# Altium schematic sheet Schaltbox-Renault_Extension.SchDoc: Schaltbox für PC I/O Erweiterung
size A3; Organization: Schleißheimer GmbH; Address2: Am Kalkofen 10; Address3: D-61206 Wöllstadt; Address4: Deutschland; Revision: 1.0; SheetNumber: 3; SheetTotal: 3; PageSetup: Record=PageOptions|CenterHorizontal=True|CenterVertical=True|PrintScale=0.70|XCorrection=1.00|YCorrection=1.00|PrintKind=0|BorderSize=5000000|LeftOffset=0|BottomOffset=0|Orientation=2|PaperLength=1000|PaperWidth=1000|Scale=100|PaperSource=7|PrintQuality=-4|MediaType=1|DitherType=10|PrintScaleMode=1|PaperKind=A4|PaperIndex=9; DocumentName: Schaltbox.SchDoc
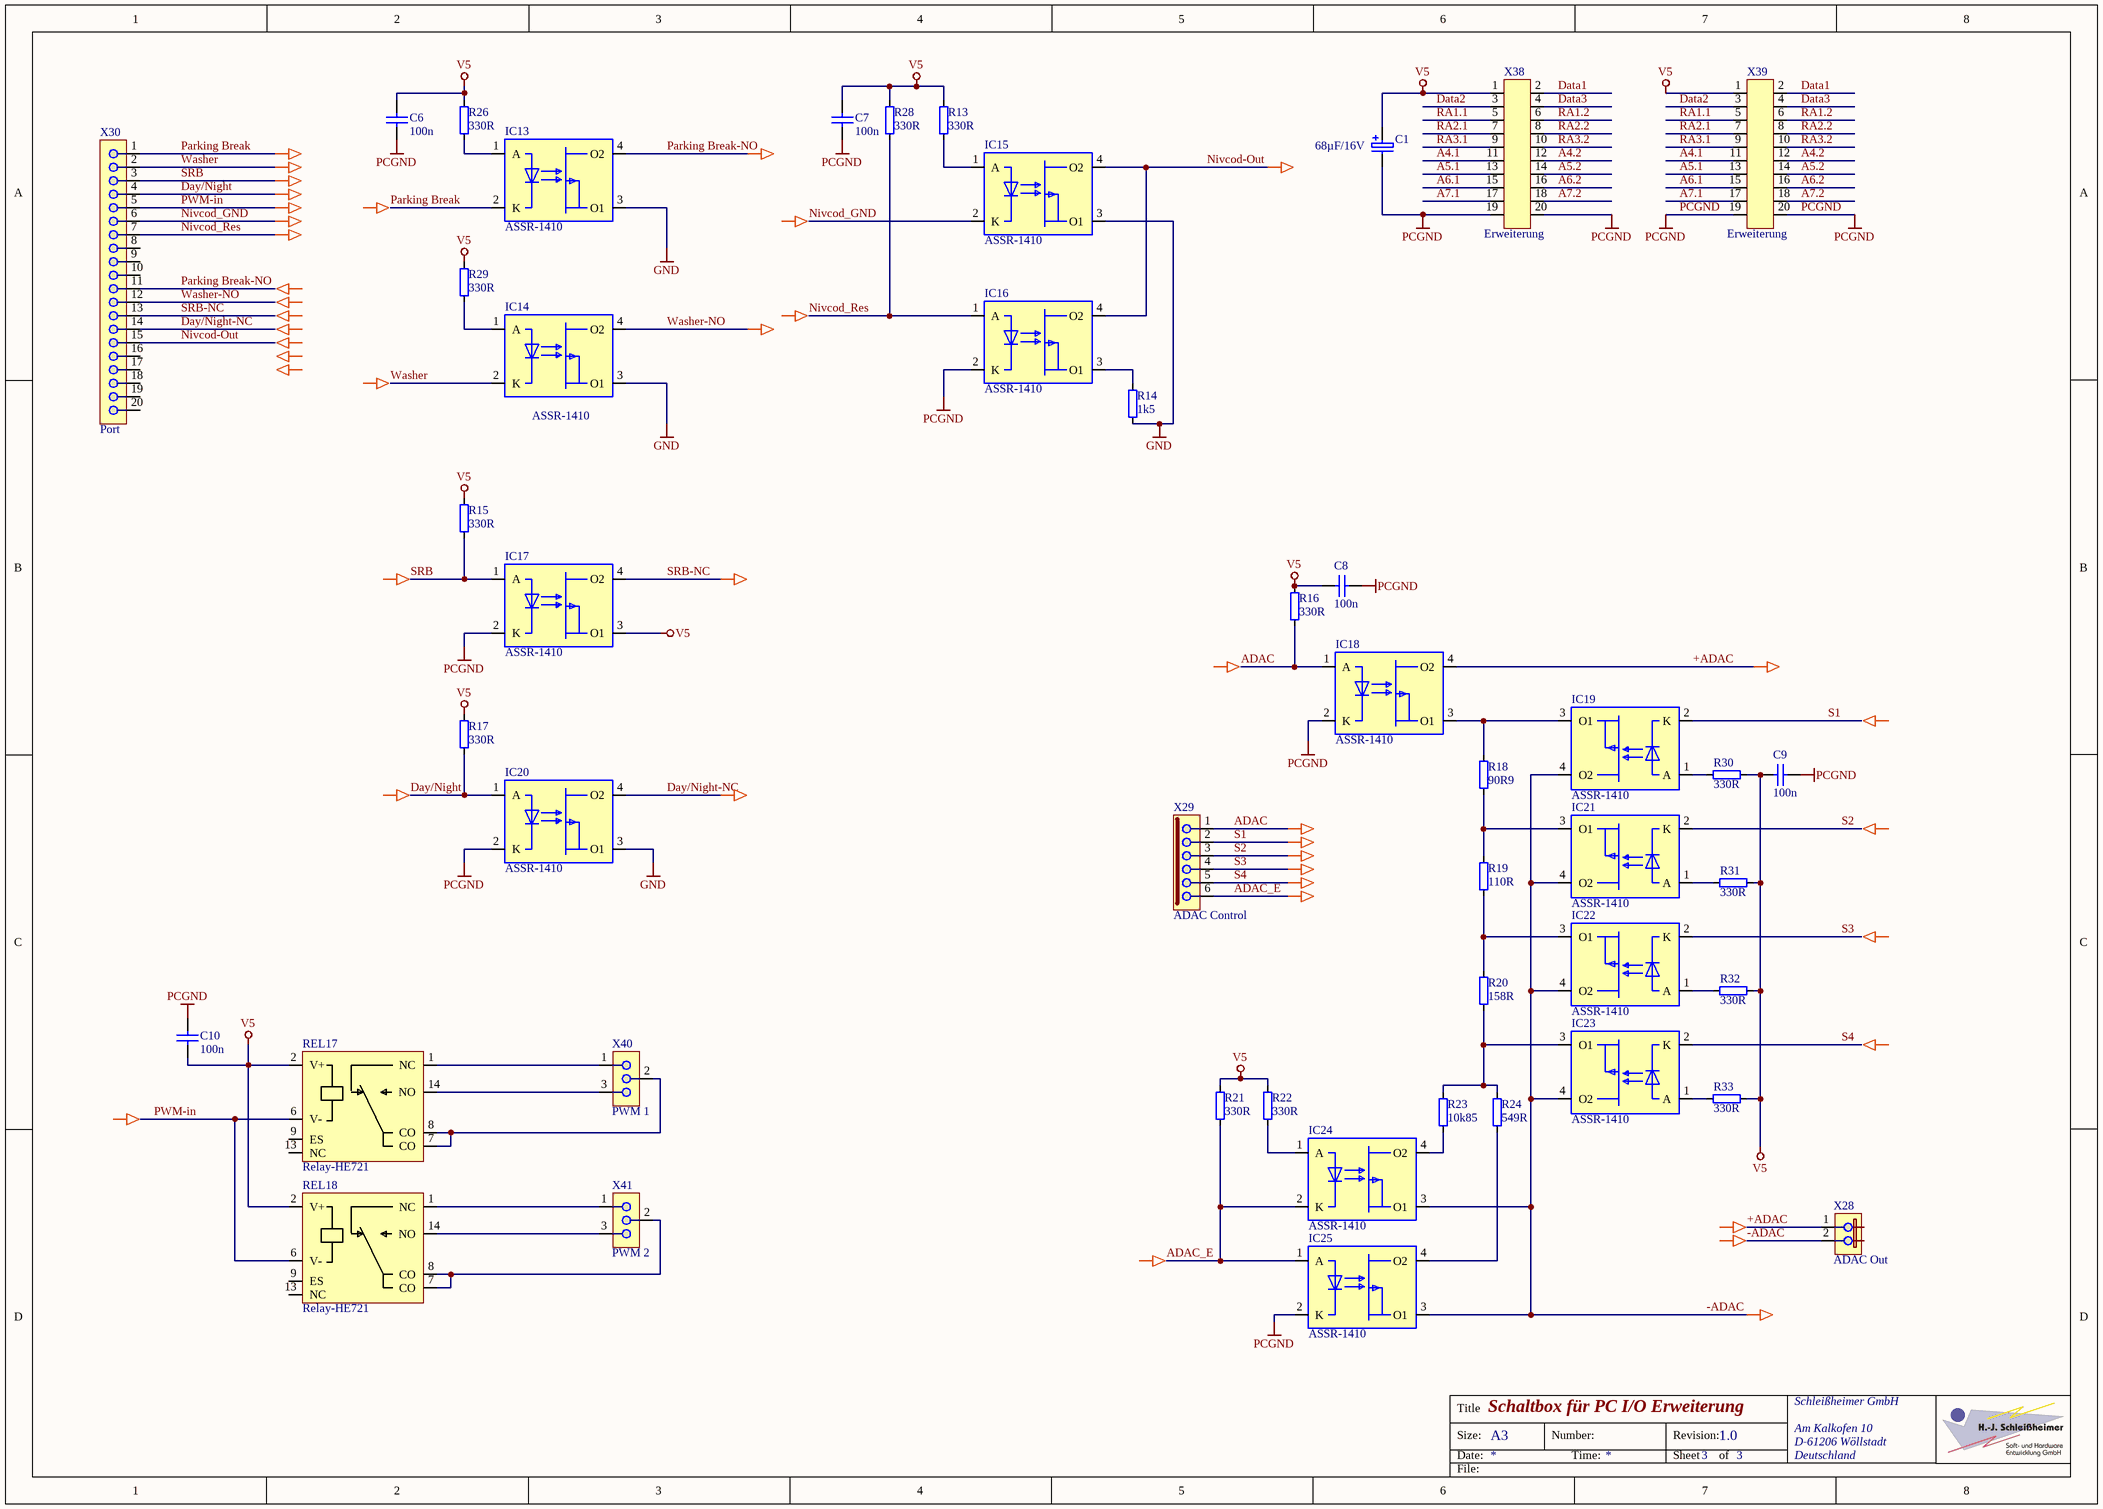
[diagram p0: Schaltbox-Renault_Extension.SchDoc]

## Parts
(Parts that share a designator on the sheet are numbered #1, #2 ... from top to bottom, then left to right.)
*#1  Pfeil-->  (value not drawn)  (graphical)
*#2  Pfeil-->  (value not drawn)  (graphical)
*#3  Pfeil-->  (value not drawn)  (graphical)
*#4  Pfeil-->  (value not drawn)  (graphical)
*#5  Pfeil-->  (value not drawn)  (graphical)
*#6  Pfeil-->  (value not drawn)  (graphical)
*#7  Pfeil-->  (value not drawn)  (graphical)
*#8  Pfeil-->  (value not drawn)  (graphical)
*#9  Pfeil-->  (value not drawn)  (graphical)
*#10  Pfeil-->  (value not drawn)  (graphical)
*#11  Pfeil-->  (value not drawn)  (graphical)
*#12  Pfeil-->  (value not drawn)  (graphical)
*#13  Pfeil-->  (value not drawn)  (graphical)
*#14  Pfeil-->  (value not drawn)  (graphical)
*#15  Pfeil-->  (value not drawn)  (graphical)
*#16  Pfeil-->  (value not drawn)  (graphical)
*#17  Pfeil-->  (value not drawn)  (graphical)
*#18  Pfeil-->  (value not drawn)  (graphical)
*#19  Pfeil-->  (value not drawn)  (graphical)
*#20  Pfeil-->  (value not drawn)  (graphical)
*#21  Pfeil-->  (value not drawn)  (graphical)
*#22  Pfeil-->  (value not drawn)  (graphical)
*#23  Pfeil-->  (value not drawn)  (graphical)
*#24  Pfeil-->  (value not drawn)  (graphical)
*#25  Pfeil-->  (value not drawn)  (graphical)
*#26  Pfeil-->  (value not drawn)  (graphical)
*#27  Pfeil-->  (value not drawn)  (graphical)
*#28  Pfeil-->  (value not drawn)  (graphical)
*#29  Pfeil-->  (value not drawn)  (graphical)
*#30  Pfeil-->  (value not drawn)  (graphical)
*#31  Pfeil-->  (value not drawn)  (graphical)
*#32  Pfeil-->  (value not drawn)  (graphical)
*#33  Pfeil-->  (value not drawn)  (graphical)
*#34  Pfeil-->  (value not drawn)  (graphical)
*#35  Pfeil-->  (value not drawn)  (graphical)
*#36  Pfeil-->  (value not drawn)  (graphical)
*#37  Pfeil-->  (value not drawn)  (graphical)
*#38  Pfeil-->  (value not drawn)  (graphical)
*#39  Pfeil-->  (value not drawn)  (graphical)
*#40  Pfeil-->  (value not drawn)  (graphical)
*#41  Pfeil-->  (value not drawn)  (graphical)
*#42  Pfeil-->  (value not drawn)  (graphical)
C1  68µF/16V  [ALU-D]
C6  100n  [C0603MD]
C7  100n  [C0603MD]
C8  100n  [C0603MD]
C9  100n  [C0603MD]
C10  100n  [C0603MD]
IC13  ASSR-1410  [SO-4]
IC14  ASSR-1410  [SO-4]
IC15  ASSR-1410  [SO-4]
IC16  ASSR-1410  [SO-4]
IC17  ASSR-1410  [SO-4]
IC18  ASSR-1410  [SO-4]
IC19  ASSR-1410  [SO-4]
IC20  ASSR-1410  [SO-4]
IC21  ASSR-1410  [SO-4]
IC22  ASSR-1410  [SO-4]
IC23  ASSR-1410  [SO-4]
IC24  ASSR-1410  [SO-4]
IC25  ASSR-1410  [SO-4]
R13  330R  [R0603MD]
R14  1k5  [R0603MD]
R15  330R  [R0603MD]
R16  330R  [R0603MD]
R17  330R  [R0603MD]
R18  90R9  [R0805MD]
R19  110R  [R0805MD]
R20  158R  [R0805MD]
R21  330R  [R0603MD]
R22  330R  [R0603MD]
R23  10k85  [R0805MD]
R24  549R  [R0805MD]
R26  330R  [R0603MD]
R28  330R  [R0603MD]
R29  330R  [R0603MD]
R30  330R  [R0603MD]
R31  330R  [R0603MD]
R32  330R  [R0603MD]
R33  330R  [R0603MD]
REL17  Relay-HE721  [DIP14 - HE700]
REL18  Relay-HE721  [DIP14 - HE700]
X28  ADAC Out  [Stifte_1x2]
X29  ADAC Control  [Stifte_1x6]
X30  Port  [Stifte_1x20]
X38  Erweiterung  [SchneidKlemm_20]
X39  Erweiterung  [SchneidKlemm_20]
X40  PWM 1  [Stifte_1x3]
X41  PWM 2  [Stifte_1x3]

## Nets
GND: IC13.3(O1) IC14.3(O1) IC15.3(O1) IC20.3(O1) R14.1
PCGND: C1.N C6.1 C7.1 C8.1 C9.1 C10.2 IC16.2(K) IC17.2(K) IC18.2(K) IC20.2(K) IC25.2(K) X38.19 X38.20 X39.19 X39.20
V5: C1.P C6.2 C7.2 C8.2 C9.2 C10.1 IC17.3(O1) R13.2 R15.2 R16.2 R17.2 R21.2 R22.2 R26.2 R28.2 R29.2 R30.1 R31.1 R32.1 R33.1 REL17.2(V+) REL18.2(V+) X38.1 X39.1
+ADAC: IC18.4(O2) X28.1
-ADAC: IC19.4(O2) IC21.4(O2) IC22.4(O2) IC23.4(O2) IC24.3(O1) IC25.3(O1) X28.2
A4.1: X38.11 X39.11
A4.2: X38.12 X39.12
A5.1: X38.13 X39.13
A5.2: X38.14 X39.14
A6.1: X38.15 X39.15
A6.2: X38.16 X39.16
A7.1: X38.17 X39.17
A7.2: X38.18 X39.18
ADAC: IC18.1(A) R16.1 X29.1
ADAC_E: IC24.2(K) IC25.1(A) R21.1 X29.6
Data1: X38.2 X39.2
Data2: X38.3 X39.3
Data3: X38.4 X39.4
Day/Night: IC20.1(A) R17.1 X30.4
Day/Night-NC: IC20.4(O2) X30.14
Nivcod-Out: IC15.4(O2) IC16.4(O2) X30.15
Nivcod_GND: IC15.2(K) X30.6
Nivcod_Res: IC16.1(A) R28.1 X30.7
Parking Break: IC13.2(K) X30.1
Parking Break-NO: IC13.4(O2) X30.11
PWM-in: REL17.6(V-) REL18.6(V-) X30.5
RA1.1: X38.5 X39.5
RA1.2: X38.6 X39.6
RA2.1: X38.7 X39.7
RA2.2: X38.8 X39.8
RA3.1: X38.9 X39.9
RA3.2: X38.10 X39.10
S1: IC19.2(K) X29.2
S2: IC21.2(K) X29.3
S3: IC22.2(K) X29.4
S4: IC23.2(K) X29.5
SRB: IC17.1(A) R15.1 X30.3
SRB-NC: IC17.4(O2) X30.13
Washer: IC14.2(K) X30.2
Washer-NO: IC14.4(O2) X30.12
NetIC13_1: IC13.1(A) R26.1
NetIC14_1: IC14.1(A) R29.1
NetIC15_1: IC15.1(A) R13.1
NetIC16_3: IC16.3(O1) R14.2
NetIC18_3: IC18.3(O1) IC19.3(O1) R18.2
NetIC19_1: IC19.1(A) R30.2
NetIC21_1: IC21.1(A) R31.2
NetIC21_3: IC21.3(O1) R18.1 R19.2
NetIC22_1: IC22.1(A) R32.2
NetIC22_3: IC22.3(O1) R19.1 R20.2
NetIC23_1: IC23.1(A) R33.2
NetIC23_3: IC23.3(O1) R20.1 R23.2 R24.2
NetIC24_1: IC24.1(A) R22.1
NetIC24_4: IC24.4(O2) R23.1
NetIC25_4: IC25.4(O2) R24.1
NetREL17_1: REL17.1(NC) X40.1
NetREL17_7: REL17.7(CO) REL17.8(CO) X40.2
NetREL17_14: REL17.14(NO) X40.3
NetREL18_1: REL18.1(NC) X41.1
NetREL18_7: REL18.7(CO) REL18.8(CO) X41.2
NetREL18_14: REL18.14(NO) X41.3

Not connected (* = marked no-connect by the designer): REL17 9(ES) 13(NC); REL18 9(ES) 13(NC); X30 8 9 10 16 17 18 19 20

## Notes on the sheet
- Title
- Size:
- Date:
- A3
- Number:
- Time:
- Revision:
- Sheet
- of
- File:

## Library data of the parts
*#1-*#42 = Pfeil-->: No Footprint
C1 = Cap Pol: Capacitor Polarized; Published: 8-Jun-2000; LatestRevisionDate: 17-Jul-2002; LatestRevisionNote: Re-released for DXP Platform.; PackageReference: C0805; Publisher: Altium Limited; Value: 68µF/16V
C6-C10 = Cap: Capacitor; Value: 100p; Published: 8-Jun-2000; LatestRevisionDate: 17-Jul-2002; LatestRevisionNote: Re-released for DXP Platform.; PackageReference: RAD-0.3; Publisher: Altium Limited
IC13-IC25 = ASSR-1410: Solid State Relay, (Photo MOSFET)
R13-R24 R26 R28-R33 = Res: Resistor
REL17 REL18 = Relay-HE721: Hamlin Reed-Relay SPDT
X28 = Jumper-2: 2pol Jumper RM 2.54
X29 = Stecker-6pol: Stecker 1reihig 6polig
X30 = Stifte 1x20: Stiftleiste, Buchsenleiste
X38 X39 = CON-2x10: Stift-, Buchs2x10, SchneidKlemm 20pol.
X40 X41 = Jumper-3: 3pol Jumper RM 2.54